# Altium schematic sheet Power.SchDoc
size A
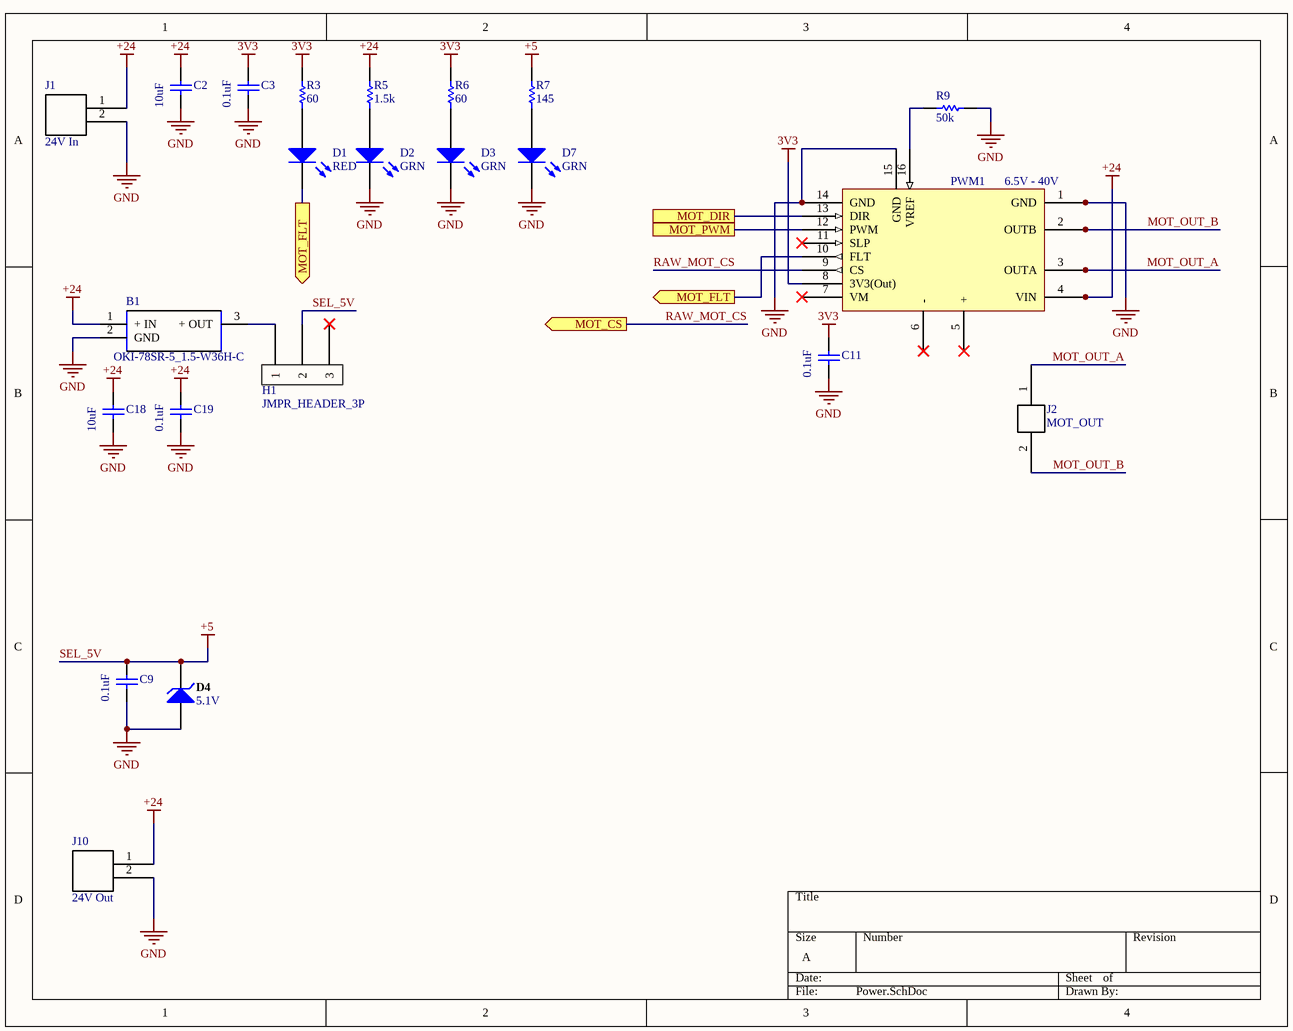
[diagram p0: Power.SchDoc]

## Parts
B1  OKI-78SR-5_1.5-W36H-C  [OKI-78SR-HORIZONTAL]
C2  value 10uF  [RESC2013X60X35LL10T20]  (hidden comment: Cap Semi)
C3  value 0.1uF  [RESC2013X60X35LL10T20]  (hidden comment: Cap Semi)
C9  value 0.1uF  [RESC2013X60X35LL10T20]  (hidden comment: Cap Semi)
C11  value 0.1uF  [RESC2013X60X35LL10T20]  (hidden comment: Cap Semi)
C18  value 10uF  [RESC2013X60X35LL10T20]  (hidden comment: Cap Semi)
C19  value 0.1uF  [RESC2013X60X35LL10T20]  (hidden comment: Cap Semi)
D1  RED  [LED]
D2  GRN  [LED]
D3  GRN  [LED]
D4  5.1V  [VISH-SOD-123-2_V]
D7  GRN  [LED]
H1  JMPR_HEADER_3P  [STD3P]
J1  24V In  [1510482204]
J2  MOT_OUT  [0430450227]
J10  24V Out  [1510482204]
PWM1  6.5V - 40V  [Pololu_G2_Driver_24v21]
R3  60  [RESC2013X60X35LL10T20]
R5  1.5k  [RESC2013X60X35LL10T20]
R6  60  [RESC2013X60X35LL10T20]
R7  145  [RESC2013X60X35LL10T20]
R9  50k  [RESC2013X60X35LL10T20]

## Ports
MOT_CS (out), MOT_DIR, MOT_FLT (out), MOT_PWM

## Nets
3V3: C3.2 C11.2 PWM1.8(3V3(Out)) R3.2 R6.2
+24: B1.1(+_IN) C2.2 C18.2 C19.2 J1.1 J10.1 PWM1.4(VIN) PWM1.4a(VIN) PWM1.4b(VIN) R5.2
GND: B1.2(GND) C2.1 C3.1 C9.1 C11.1 C18.1 C19.1 D2.2(K) D3.2(K) D4.1(A) D7.2(K) J1.2 J10.2 PWM1.1(GND) PWM1.1a(GND) PWM1.1b(GND) PWM1.14(GND) PWM1.15(GND) R9.1
SEL_5V: C9.2 D4.2(K) H1.2 R7.2  [also labelled +5]
MOT_DIR: PWM1.13(DIR) ; port MOT_DIR
MOT_FLT: D1.2(K) PWM1.10(FLT) ; port MOT_FLT
MOT_OUT_A: J2.1 PWM1.3(OUTA) PWM1.3a(OUTA) PWM1.3b(OUTA)
MOT_OUT_B: J2.2 PWM1.2(OUTB) PWM1.2a(OUTB) PWM1.2b(OUTB)
MOT_PWM: PWM1.12(PWM) ; port MOT_PWM
RAW_MOT_CS: PWM1.9(CS) ; port MOT_CS
NetB1_3: B1.3(+_OUT) H1.1
NetD1_1: D1.1(A) R3.1
NetD2_1: D2.1(A) R5.1
NetD3_1: D3.1(A) R6.1
NetD7_1: D7.1(A) R7.1
NetPWM1_16: PWM1.16(VREF) R9.2

Not connected (* = marked no-connect by the designer): H1 3*; PWM1 5(+)* 6(-)* 7(VM)* 11(SLP)*

## Library data of the parts
B1 = OKI-78SR-5_1.5-W36H-C: Switching Regulator 7-36Vin 5Vo 1.5A Non-Isolated DC-DC Converter, 5V dc Output, 1.5A; Manufacturer_Name: Murata Electronics; Manufacturer_Part_Number: OKI-78SR-5/1.5-W36H-C; Mouser Part Number: 580-OKI78SR51.5W36HC; Datasheet Link: https://componentsearchengine.com/Datasheets/1/OKI-78SR-5_1.5-W36H-C.pdf
C2 C3 C9 C11 C18 C19 = Cap Semi: Capacitor (Semiconductor SIM Model); Published: 8-Jun-2000; LatestRevisionDate: 29-May-2009; LatestRevisionNote: IPC-7351 Footprint Added.; PackageReference: C1206; Publisher: Altium Limited; PackageDescription: Chip Capacitor
D1-D3 D7 = LED0: Typical INFRARED GaAs LED; Published: 8-Jun-2000; LatestRevisionDate: 08-Jul-2005; LatestRevisionNote: Mech Layer 1 removed.; PackageReference: LED-0; Publisher: Altium Limited; PackageDescription: LED; 2 Leads
D4 = CMP-0931-00020-1: Manufacturer: Vishay Semiconductor; PartNumber: MMSZ5232B-E3-08; Power Dissipation (mW): 500; Test Current (IZT1) (mA): 20; Zener Voltage (NOM.) (V): 5.6; Zener Impedance (IZT1) (Max.) (Ohm): 11; Tolerance: +/- 5%; Packing: Tape and Reel; Int. Construction: Single; ComponentLink2URL: http://www.vishay.com/docs/85774/mmsz5225.pdf; PackageVersion: Rev. 1.9; Operating Temperature: -55 to 150 degC; ComponentLink1Description: Manufacturer URL; ComponentLink3Description: Package Specification; DatasheetVersion: Rev. 1.9; PackageReference: SOD-123-2; ComponentLink3URL: http://www.vishay.com/docs/85774/mmsz5225.pdf; PackageDescription: 2-Pin SMD, Body 2.7 x 1.55 mm, Height 1.35 mm; ComponentLink1URL: http://www.vishay.com/; RoHS: TRUE; ComponentLink2Description: Datasheet; Mounting Technology: Surface Mount
J1 J10 = Molex 6.5MM 2 pin connector: Molex 6.5MM 2 pin connector, used for power connections. P/N 1510482204 and similar models.
J2 = Molex micro-fit 2-pin: Molex micro-fit 3.0. Molex P/N 0430450227
PWM1 = Pololu G2 High-Power Motor Driver 24v21: This discrete MOSFET H-bridge motor driver enables bidirectional control of one high-power DC brushed motor. The small 1.3″ × 0.8″ board supports a wide 6.5 V to 40 V voltage range and is efficient enough to deliver a continuous 21 A without a heat sink. Additional features of this second-generation (G2) driver include reverse-voltage protection along with basic current sensing and current limiting functionality.; ComponentLink1Description: Product Info; ComponentLink1URL: https://www.pololu.com/product/2995/specs
R3 R5-R7 R9 = RES-2